# EAGLE design blinky_5.0 (EAGLE 9.5.2)
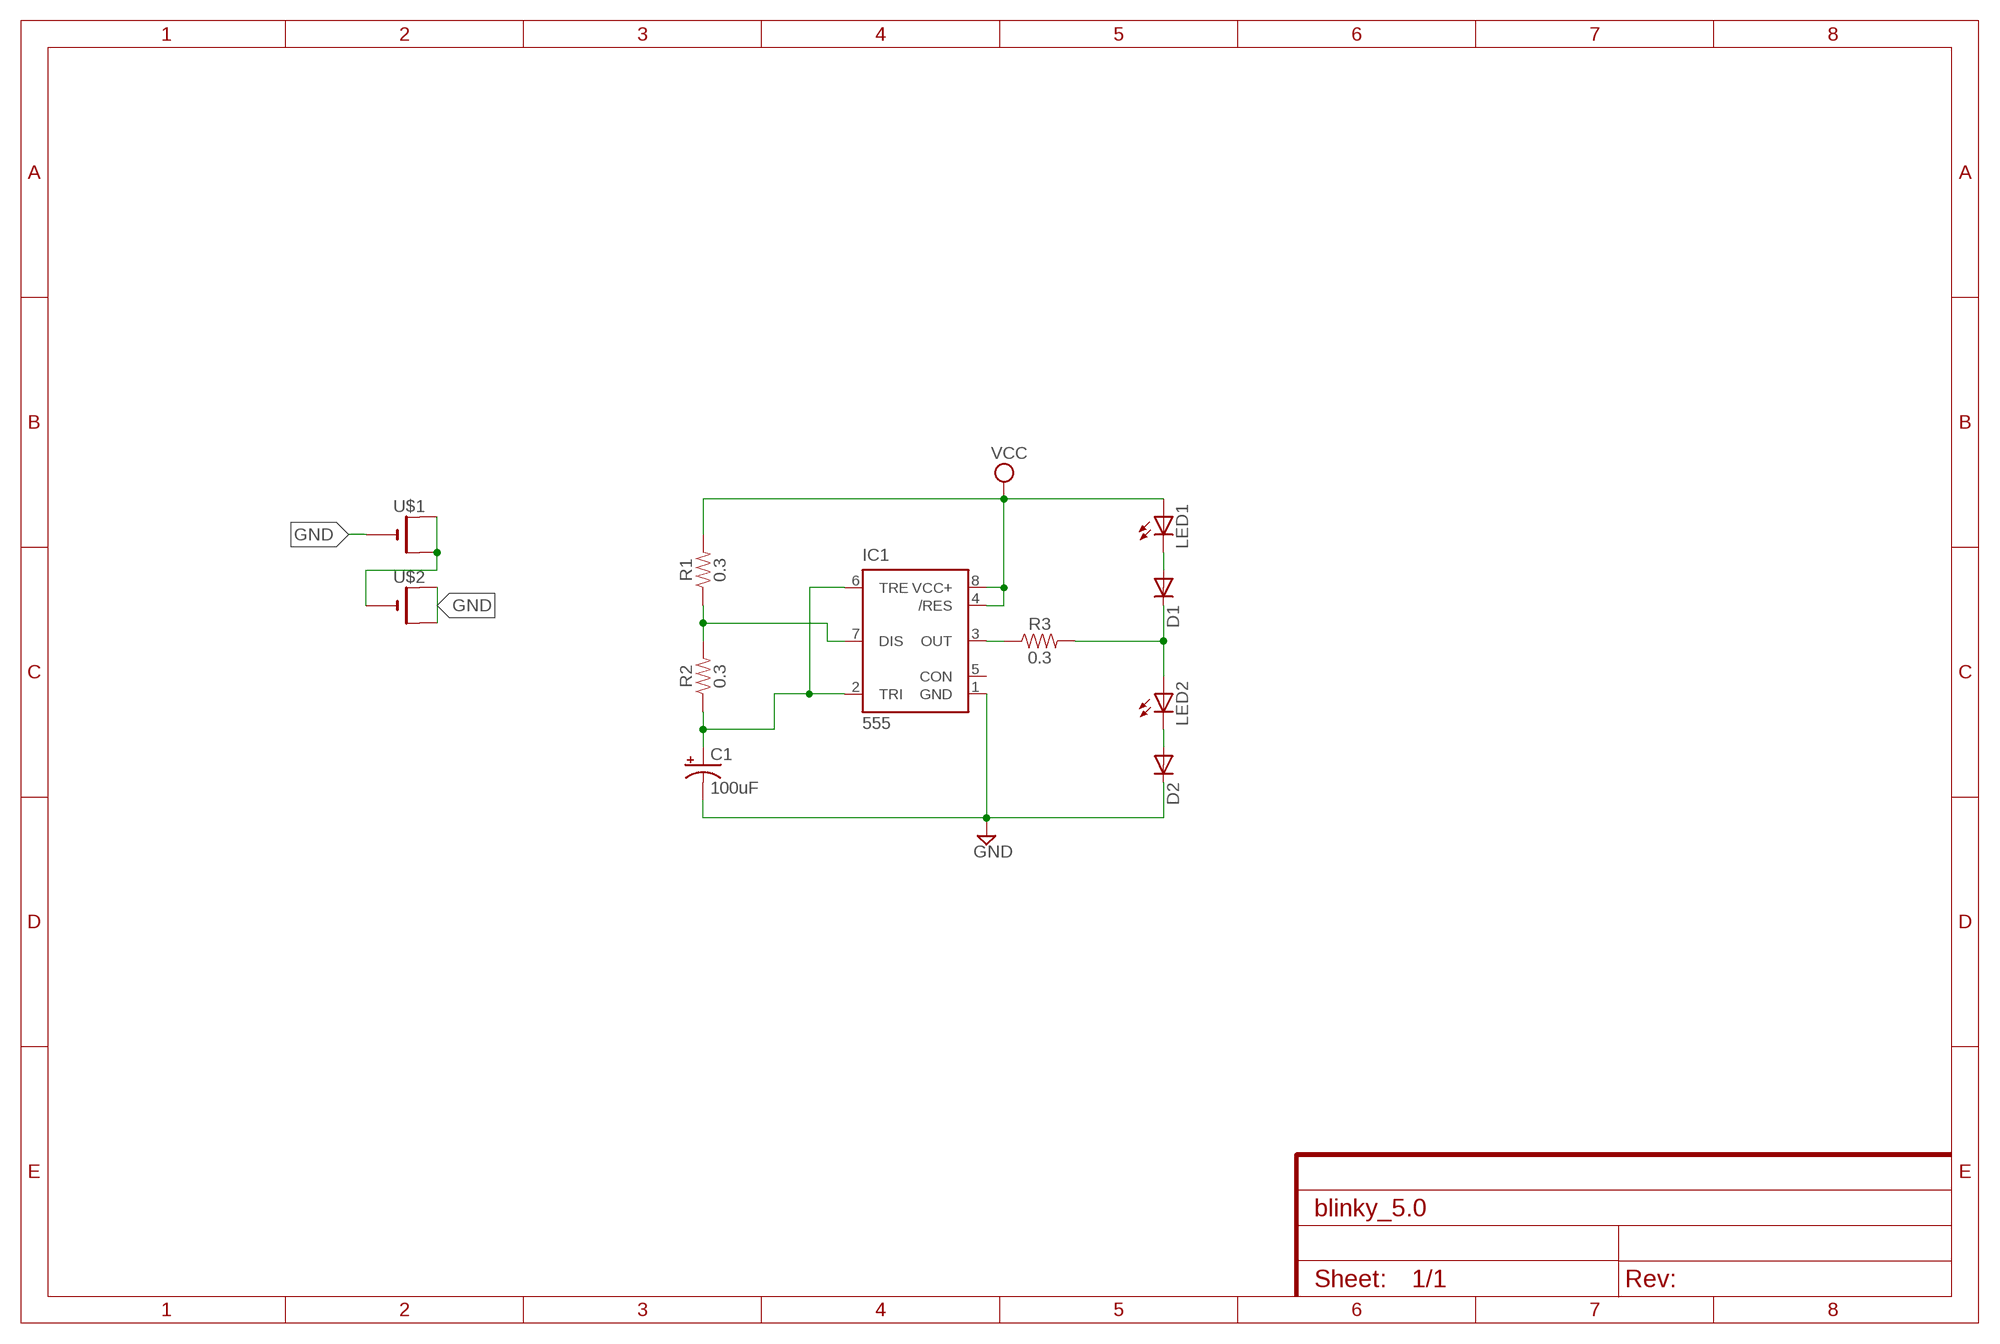
[diagram p0: schematic, sheet 1]

## Parts
C1  100uF  100UF-POLAR-10X10.5-63V-20%  [NIC_10X10.5_CAP]
D1  1N4004  [DO41-10]
D2  1N4004  [DO41-10]
IC1  555  555D  [SO08]
LED1  LED5MM  [LED5MM]
LED2  LED5MM  [LED5MM]
R1  0.3  0.3OHM-0805-1/8W-1%  [0805]
R2  0.3  0.3OHM-0805-1/8W-1%  [0805]
R3  0.3  0.3OHM-0805-1/8W-1%  [0805]
U$1  CR1220SMT  [CR1220-SMD]
U$2  CR1220SMT  [CR1220-SMD]

## Nets
GND: C1.- D2.C IC1.1(GND) U$1.- U$2.+$1(+) U$2.+$2(+1)
N$1: IC1.7(DIS) R1.1 R2.2
N$2: C1.+ IC1.2(TRI) IC1.6(TRE) R2.1
N$3: U$1.+$1(+) U$1.+$2(+1) U$2.-
N$7: D2.A LED2.K(C)
N$8: D1.C LED2.A R3.2
N$9: D1.A LED1.K(C)
N$11: IC1.3(OUT) R3.1
VCC: IC1.4(/RES) IC1.8(VCC+) LED1.A R1.2
Unconnected: IC1.5(CON)

## Library data of the parts
C1 = SparkFun-Capacitors:100UF-POLAR: 100µF polarized capacitors A capacitor is a passive two-terminal electrical component used to store electrical energy temporarily in an electric field.; PROD_ID: CAP-08362
D1 D2 = adafruit:1N4004: DIODE General purpose 1N400x type rectifier (With bigger pads) http://www.ladyada.net/library/pcb/eaglelibrary.html
IC1 = SparkFun-IC-Special-Function:555: General purpose bipolar Timer Datasheet <http://www.sparkfun.com/datasheets/Components/General/ne555.pdf> SparkFun Products SparkFun SparkPunk Sequencer Kit <https://www.sparkfun.com/products/12707> (KIT-12707) Storefront Component: 555 Timer <https://www.sparkfun.com/products/9273> (COM-09273) Two parts valid for production: VFP: IC-11930 (M7555 PTH) VFP: IC-09173 (555 PTH) - Preferred; PROD_ID: NA-XXXXX
LED1 LED2 = adafruit:LED: LED OSRAM: - CHIPLED LG R971, LG N971, LY N971, LG Q971, LY Q971, LO R971, LY R971 LH N974, LH R974 LS Q976, LO Q976, LY Q976 LO Q996 - Hyper CHIPLED LW Q18S LB Q993, LB Q99A, LB R99A - SideLED LS A670, LO A670, LY A670, LG A670, LP A670 LB A673, LV A673, LT A673, LW A673 LH A674 LY A675 LS A676, LA A676, LO A676, LY A676, LW A676 LS A679, LY A679, LG A679 - Hyper Micro SIDELED® LS Y876, LA Y876, LO Y876, LY Y876 LT Y87S - SmartLED LW L88C, LW L88S LB L89C, LB L89S, LG L890 LS L89K, LO L89K, LY L89K LS L896, LA L896, LO L896, LY L896 - TOPLED LS T670, LO T670, LY T670, LG T670, LP T670 LSG T670, LSP T670, LSY T670, LOP T670, LYG T670 LG T671, LOG T671, LSG T671 LB T673, LV T673, LT T673, LW T673 LH T674 LS T676, LA T676, LO T676, LY T676, LB T676, LH T676, LSB T676, LW T676 LB T67C, LV T67C, LT T67C, LS T67K, LO T67K, LY T67K, LW E67C LS E67B, LA E67B, LO E67B, LY E67B, LB E67C, LV E67C, LT E67C LW T67C LS T679, LY T679, LG T679 LS T770, LO T770, LY T770, LG T770, LP T770 LB T773, LV T773, LT T773, LW T773 LH T774 LS E675, LA E675, LY E675, LS T675 LS T776, LA T776, LO T776, LY T776, LB T776 LHGB T686 LT T68C, LB T68C - Hyper Mini TOPLED® LB M676 - Mini TOPLED Santana® LG M470 LS M47K, LO M47K, LY M47K Source: http://www.osram.convergy.de/
R1-R3 = SparkFun-Resistors:0.3OHM: 0.3Ω resistor A resistor is a passive two-terminal electrical component that implements electrical resistance as a circuit element. Resistors act to reduce current flow, and, at the same time, act to lower voltage levels within circuits. - Wikipedia; PROD_ID: RES-11622
U$1 U$2 = adafruit:CR1220: CR1216/CR1220/CR1225 12mm 3V lithium coin cell Great for battery packup. Both SMT and THM holders. Note the THM package has the ground pads on both sides of the PCB so that the masks are the same - this reduces the cost

## Board
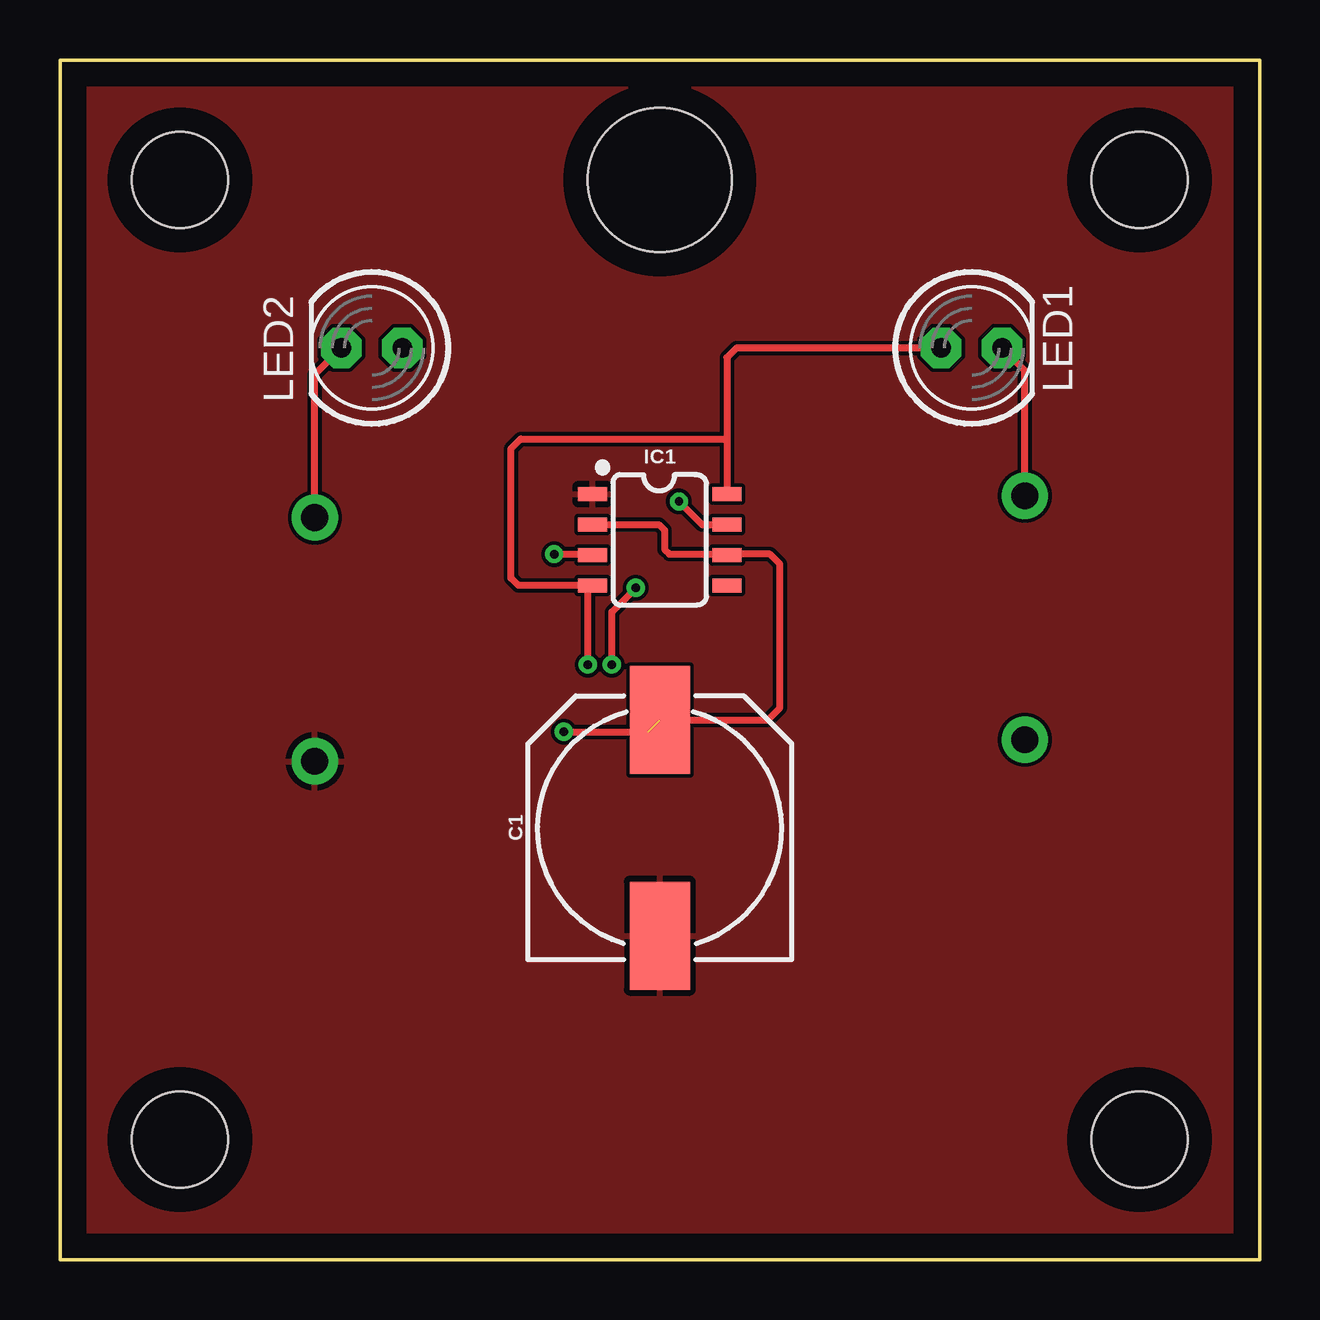
[diagram p1: board, top side]
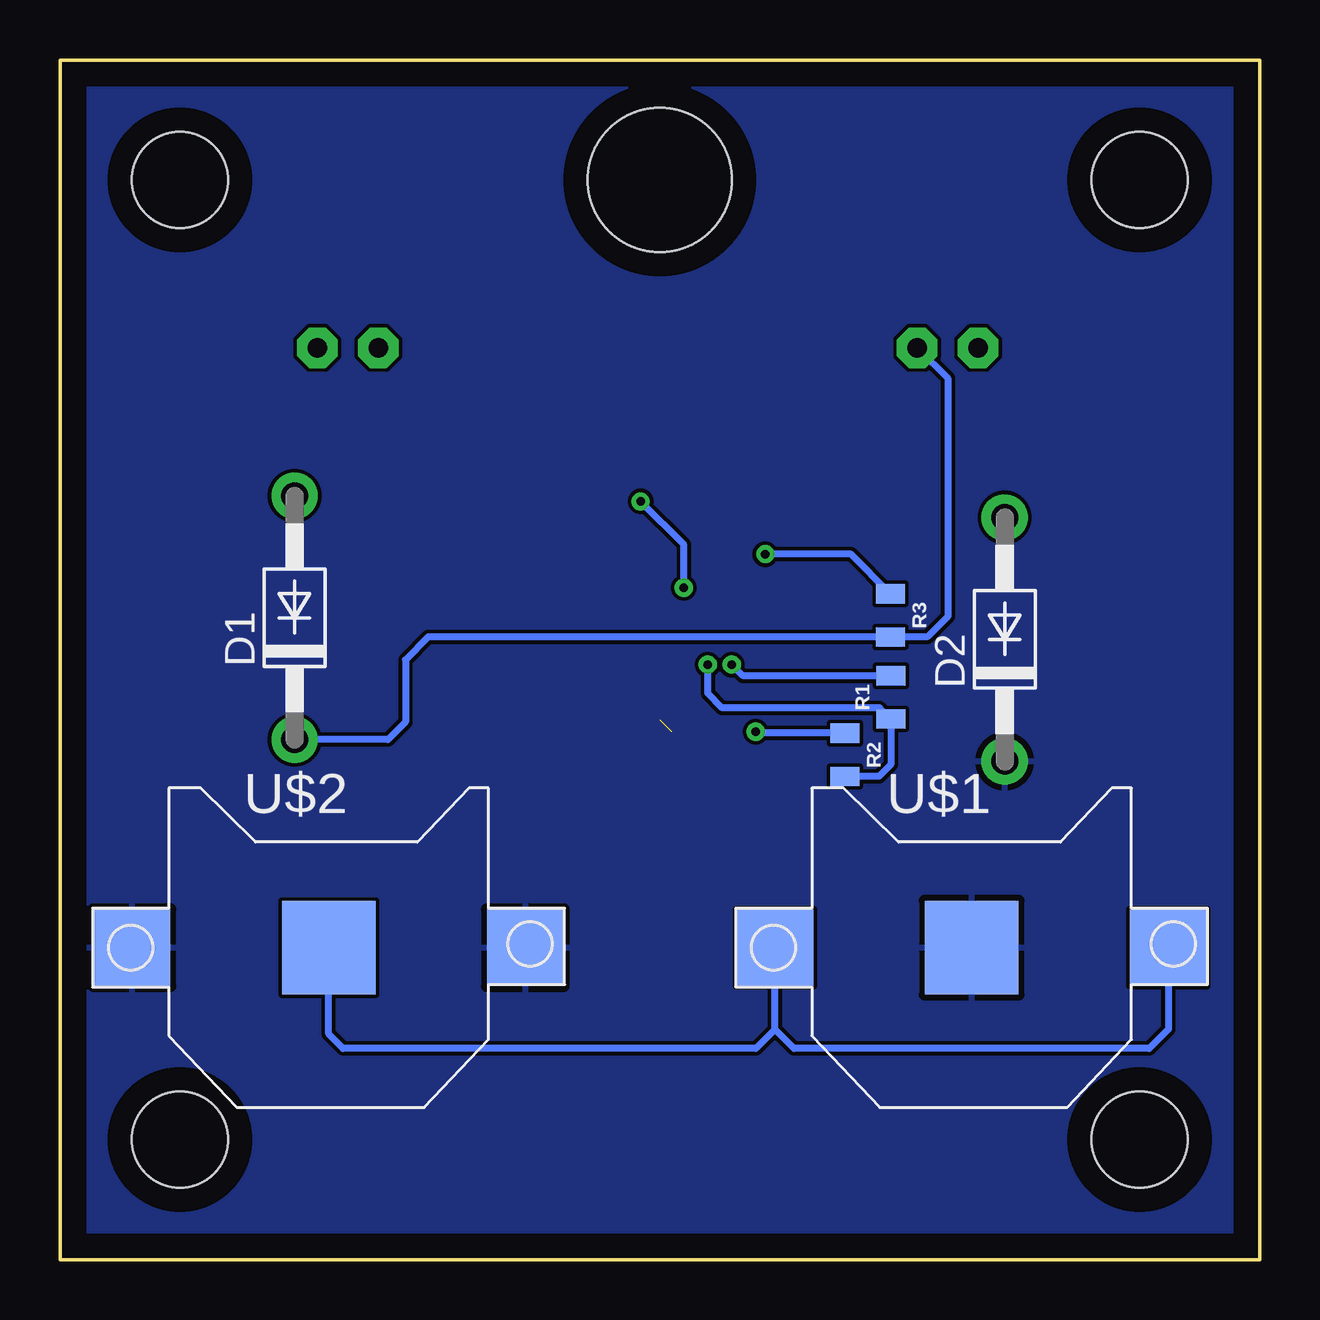
[diagram p2: board, bottom side, seen from below]

Size 50 x 50 mm. Coordinates in mm from the lower left corner, seen from the top.
Outline: 0,0 0,50 50,50 50,0 0,0
Copper layers (1*16): Top 0.035mm / dielectric 1.5mm / Bottom 0.035mm
Design rules "default": minimum track width 6mil, minimum drill 0.35mm, track to track 6mil, track to pad 6mil, pad to pad 6mil, via to via 6mil, smd to smd 6mil, copper to edge 40mil, drill to drill 6mil, minimum pad ring 10mil, minimum via ring 8mil, stop-mask expansion 4mil, vias tented up to drill 0mil, thermal gap 10mil
Holes 4 mm at 5,45 45,45 45,5 5,5
Holes 6 mm at 25,45

### Footprints (pad centres in the part's own frame; a part is rotated, then mirrored left to right if it is on the bottom)
NIC_10X10.5_CAP = smd 4.5 x 2.5: + 4.5,0; - -4.5,0
DO41-10 = drill 1.118 pad 1.93: A 5.08,0; C -5.08,0
SO08 = smd 0.6 x 1.2: 1 -1.905,-2.8; 2 -0.635,-2.8; 3 0.635,-2.8; 4 1.905,-2.8; 5 1.905,2.8; 6 0.635,2.8; 7 -0.635,2.8; 8 -1.905,2.8
LED5MM = drill 0.813 pad 1.676 octagon: A -1.27,0; K 1.27,0
0805 = smd 0.8 x 1.2: 1 -0.9,0; 2 0.9,0
CR1220-SMD = smd 3.2 x 3.2: +$1 -8.2,0; +$2 8.2,0 | smd 3.9 x 3.9: - 0,0

### Placement (x,y rotation side)
C1  25,18 90 top
D1  40.22,26.75 90 bottom
D2  10.62,25.85 90 bottom
IC1  25,30 270 top
LED1  38,38 0 top
LED2  13,38 180 top
R1  15.37,23.43 90 bottom
R2  17.28,21.04 270 bottom
R3  15.38,26.85 270 bottom
U$1  12,13 0 bottom
U$2  38.8,13 0 bottom

### Tracks (layer width: path | path; a pad name or v marks a point on that pad's centre or on a via)
GND
  pour Top: 0,50 0,0 50,0 50,50
  pour Bottom: 50,0 0,0 0,50 50,50
N$1  (via drill 0.35)
  Top 0.3: v23,24.8 23,27 v24,28 | v25.8,31.6 26.77,30.64 IC1.7
  Bottom 0.3: R2.2 15.86,20.14 15.37,20.63 R1.1 15.84,23 22.4,23 23,23.6 v23,24.8 | v25.8,31.6 24,29.8 v24,28
N$2  (via drill 0.35)  (1 unrouted)
  Top 0.3: v21,22 24.5,22 | C1.+ 29.5,22.5 30,23 30,29 29.6,29.4 27.84,29.4 | 27.84,29.4 IC1.6 | IC1.2 24.96,30.64 25.2,30.4 25.2,29.6 25.4,29.4 27.84,29.4
  Bottom 0.3: R2.1 20.94,21.94 v21,22
N$3
  Bottom 0.3: U$1.+$2 3.8,9.6 4.6,8.8 19.4,8.8 20.2,9.6 | 20.2,9.6 U$1.+$1 | 20.2,9.6 21,8.8 38.2,8.8 38.8,9.4 U$2.-
N$7
  Top 0.3: D2.A 10.62,36.89 LED2.K
N$8
  Bottom 0.3: LED2.A 13,36.73 13,26.8 13.85,25.95 R3.2 34.65,25.95 35.6,25 35.6,22.4 36.33,21.67 D1.C
N$9
  Top 0.3: D1.A 40.22,37.05 LED1.K
N$11  (via drill 0.35)
  Top 0.3: v20.6,29.4 22.16,29.4 IC1.3
  Bottom 0.3: v20.6,29.4 17.03,29.4 R3.1
VCC  (via drill 0.35)
  Top 0.3: LED1.A 28.2,38 27.8,37.6 27.8,34.2 | 27.8,34.2 IC1.8 | v22,24.8 22,27.89 IC1.4 19.11,28.09 18.8,28.4 18.8,33.8 19.2,34.2 27.8,34.2
  Bottom 0.3: R1.2 21.53,24.33 v22,24.8